# EAGLE schematic ATX_VGA_Analog_Board (EAGLE 9.6.2)
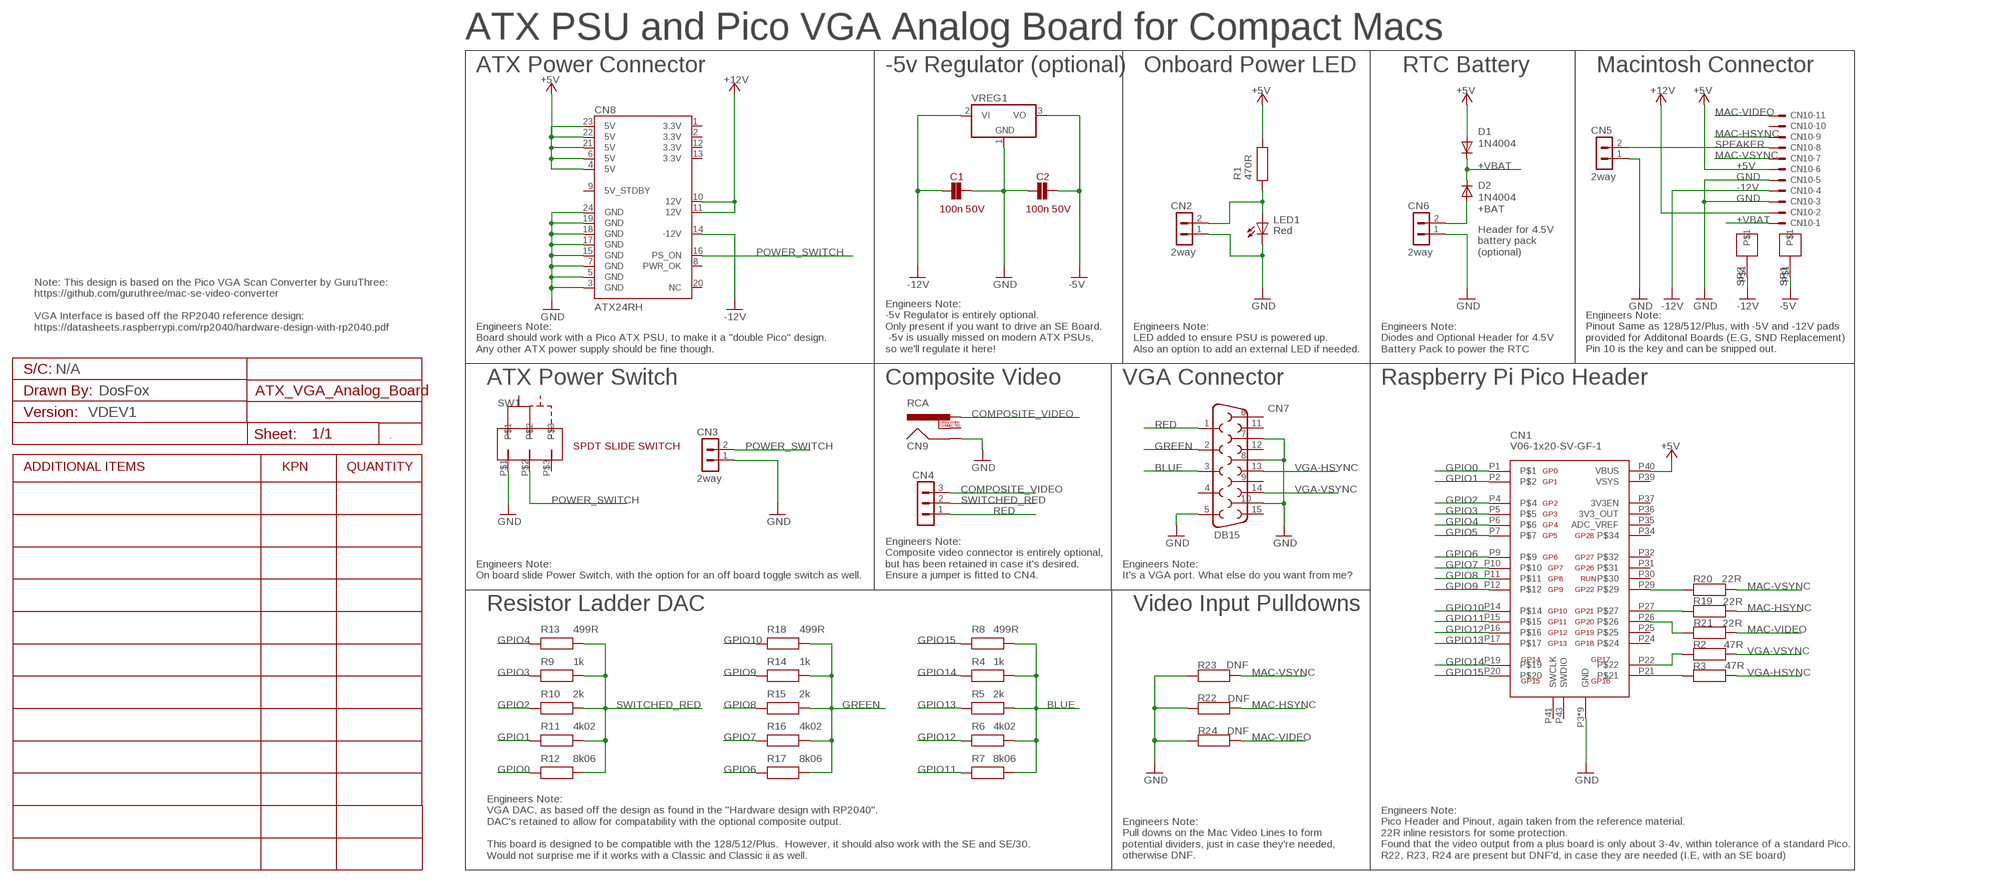
[diagram p0: schematic, sheet 1]

## Parts
A1  VDEV1  PROJECT_DETAILS_CUSTOM  [PCB_CUSTOM_DETAILS]
C1  100n 50V  100N_TH_CAP  [CAP_5.08MM_PITCH]
C2  100n 50V  100N_TH_CAP  [CAP_5.08MM_PITCH]
CN1  V06-1x20-SV-GF-1  PICO_BOARD  [PICO_SOCKET]
CN2  2way  PIN_HEADER_2W_VERT_TH  [2W_2.54MM_PITCH_VERT_TH]
CN3  2way  PIN_HEADER_2W_VERT_TH  [2W_2.54MM_PITCH_VERT_TH]
CN4  V06-1x3-SV-GF-1  PIN_HEADER_3W_VERT_FEMALE_TH  [3W_2.54MM_PITCH_VERT_TH]
CN5  2way  PIN_HEADER_2W_VERT_TH  [2W_2.54MM_PITCH_VERT_TH]
CN6  2way  PIN_HEADER_2W_VERT_TH  [2W_2.54MM_PITCH_VERT_TH]
CN7  DB15  [DB15]
CN8  ATX24RH  [ATX24_RIGHT_ANGLE]
CN9  RCA  [RCA]
CN10  KK-156-11  [KK-156-11]
D1  1N4004  [DO41-10]
D2  1N4004  [DO41-10]
LED1  Red  5MM_LED_RED  [5MM_TH_VERT_STANDARD]
R1  470R  470R_TH_RESISTOR  [RESISTORTHRUHOLE]
R2  47R  47R_TH_RESISTOR  [RESISTORTHRUHOLE]
R3  47R  47R_TH_RESISTOR  [RESISTORTHRUHOLE]
R4  1k  1K_TH_RESISTOR  [RESISTORTHRUHOLE]
R5  2k  2K2_TH_RESISTOR  [RESISTORTHRUHOLE]
R6  4k02  4K7_TH_RESISTOR  [RESISTORTHRUHOLE]
R7  8k06  68K_TH_RESISTOR  [RESISTORTHRUHOLE]
R8  499R  470R_TH_RESISTOR  [RESISTORTHRUHOLE]
R9  1k  1K_TH_RESISTOR  [RESISTORTHRUHOLE]
R10  2k  2K2_TH_RESISTOR  [RESISTORTHRUHOLE]
R11  4k02  4K7_TH_RESISTOR  [RESISTORTHRUHOLE]
R12  8k06  68K_TH_RESISTOR  [RESISTORTHRUHOLE]
R13  499R  470R_TH_RESISTOR  [RESISTORTHRUHOLE]
R14  1k  1K_TH_RESISTOR  [RESISTORTHRUHOLE]
R15  2k  2K2_TH_RESISTOR  [RESISTORTHRUHOLE]
R16  4k02  4K7_TH_RESISTOR  [RESISTORTHRUHOLE]
R17  8k06  68K_TH_RESISTOR  [RESISTORTHRUHOLE]
R18  499R  470R_TH_RESISTOR  [RESISTORTHRUHOLE]
R19  22R  22R_TH_RESISTOR  [RESISTORTHRUHOLE]
R20  22R  22R_TH_RESISTOR  [RESISTORTHRUHOLE]
R21  22R  22R_TH_RESISTOR  [RESISTORTHRUHOLE]
R22  DNF  22R_TH_RESISTOR  [RESISTORTHRUHOLE]
R23  DNF  22R_TH_RESISTOR  [RESISTORTHRUHOLE]
R24  DNF  22R_TH_RESISTOR  [RESISTORTHRUHOLE]
SP1  1PIN  [1PIN]
SP2  1PIN  [1PIN]
SW1  SS12D16-GDN5  [THRUHOLE90DEGSLIDESW]
VREG1  7905T  [TO220H]

## Nets
+5V: CN1.P40(VBUS) CN8.4(5V) CN8.6(5V) CN8.21(5V) CN8.22(5V) CN8.23(5V) CN10.6 D1.A R1.P$2 ; supply symbol labelled 3V3
+12V: CN8.10(12V) CN8.11(12V) CN10.2 ; supply symbol labelled 3V3
+BAT: CN6.2 D2.A
+VBAT: CN10.1 D1.C D2.C
-5V: C2.P$2 SP1.P$1 VREG1.3(VO) ; supply symbol labelled GND
-12V: C1.P$1 CN8.14(-12V) CN10.4 SP2.P$1 VREG1.2(VI) ; supply symbol labelled GND
BLUE: CN7.3 R4.P$2 R5.P$2 R6.P$2 R7.P$2 R8.P$2
COMPOSITE_VIDEO: CN4.3 CN9.PIN
GND: C1.P$2 C2.P$1 CN1.P3(GND) CN1.P8(GND) CN1.P13(GND) CN1.P18(GND) CN1.P23(GND) CN1.P28(GND) CN1.P33(GND) CN1.P38(GND) CN1.P42(GND) CN2.1 CN3.1 CN5.1 CN6.1 CN7.5 CN7.7 CN7.8 CN7.10 CN8.3(GND) CN8.5(GND) CN8.7(GND) CN8.15(GND) CN8.17(GND) CN8.18(GND) CN8.19(GND) CN8.24(GND) CN9.SHELL CN10.3 CN10.5 LED1.C R22.P$1 R23.P$1 R24.P$1 SW1.P$1 VREG1.1(GND)
GPIO0: CN1.P1 R12.P$1
GPIO1: CN1.P2 R11.P$1
GPIO2: CN1.P4 R10.P$1
GPIO3: CN1.P5 R9.P$1
GPIO4: CN1.P6 R13.P$1
GPIO5: CN1.P7
GPIO6: CN1.P9 R17.P$1
GPIO7: CN1.P10 R16.P$1
GPIO8: CN1.P11 R15.P$1
GPIO9: CN1.P12 R14.P$1
GPIO10: CN1.P14 R18.P$1
GPIO11: CN1.P15 R7.P$1
GPIO12: CN1.P16 R6.P$1
GPIO13: CN1.P17 R5.P$1
GPIO14: CN1.P19 R4.P$1
GPIO15: CN1.P20 R8.P$1
GREEN: CN7.2 R14.P$2 R15.P$2 R16.P$2 R17.P$2 R18.P$2
MAC-HSYNC: CN10.9 R19.P$2 R22.P$2
MAC-VIDEO: CN10.11 R21.P$2 R24.P$2
MAC-VSYNC: CN10.7 R20.P$2 R23.P$2
N$1: CN2.2 LED1.A R1.P$1
N$2: CN1.P22 R2.P$1
N$3: CN1.P21 R3.P$1
N$4: CN1.P29 R20.P$1
N$5: CN1.P27 R19.P$1
N$6: CN1.P26 R21.P$1
POWER_SWITCH: CN3.2 CN8.16(PS_ON) SW1.P$2
RED: CN4.1 CN7.1
SPEAKER: CN5.2 CN10.8
SWITCHED_RED: CN4.2 R9.P$2 R10.P$2 R11.P$2 R12.P$2 R13.P$2
VGA-HSYNC: CN7.13 R3.P$2
VGA-VSYNC: CN7.14 R2.P$2
Unconnected: CN1.P24 CN1.P25 CN1.P30 CN1.P31 CN1.P32 CN1.P34 CN1.P35(ADC_VREF) CN1.P36(3V3_OUT) CN1.P37(3V3EN) CN1.P39(VSYS) CN1.P41(SWCLK) CN1.P43(SWDIO) CN7.4 CN7.6 CN7.9 CN7.11 CN7.12 CN7.15 CN8.1(3.3V) CN8.2(3.3V) CN8.8(PWR_OK) CN8.9(5V_STDBY) CN8.12(3.3V) CN8.13(3.3V) CN8.20(NC) CN9.SWITCH CN10.10 SW1.P$3

## Notes on the sheet
- ATX PSU and Pico VGA Analog Board for Compact Macs
- ATX Power Connector | -5v Regulator (optional) | Onboard Power LED | RTC Battery | Macintosh Connector
- Header for 4.5V
  battery pack
  (optional)
- Note: This design is based on the Pico VGA Scan Converter by GuruThree:
  https://github.com/guruthree/mac-se-video-converter
  
  VGA Interface is based off the RP2040 reference design:
  https://datasheets.raspberrypi.com/rp2040/hardware-design-with-rp2040.pdf
- Engineers Note:
  Board should work with a Pico ATX PSU, to make it a "double Pico" design. 
  Any other ATX power supply should be fine though.
- Engineers Note:
  -5v Regulator is entirely optional. 
  Only present if you want to drive an SE Board.
   -5v is usually missed on modern ATX PSUs, 
  so we'll regulate it here!
- Engineers Note:
  LED added to ensure PSU is powered up.
  Also an option to add an external LED if needed.
- Engineers Note:
  Diodes and Optional Header for 4.5V
  Battery Pack to power the RTC
- Engineers Note:
  Pinout Same as 128/512/Plus, with -5V and -12V pads
  provided for Additonal Boards (E.G, SND Replacement)
  Pin 10 is the key and can be snipped out.
- N/A
- ATX Power Switch | Composite Video | VGA Connector | Raspberry Pi Pico Header
- DosFox
- Engineers Note:
  On board slide Power Switch, with the option for an off board toggle switch as well.
- Engineers Note:
  Composite video connector is entirely optional,
  but has been retained in case it's desired. 
  Ensure a jumper is fitted to CN4.
- Engineers Note:
  It's a VGA port. What else do you want from me?
- Resistor Ladder DAC | Video Input Pulldowns
- Engineers Note:
  VGA DAC, as based off the design as found in the "Hardware design with RP2040". 
  DAC's retained to allow for compatability with the optional composite output. 
  
  This board is designed to be compatible with the 128/512/Plus.  However, it should also work with the SE and SE/30. 
  Would not surprise me if it works with a Classic and Classic ii as well.
- Engineers Note:
  Pull downs on the Mac Video Lines to form 
  potential dividers, just in case they're needed,
  otherwise DNF.
- Engineers Note:
  Pico Header and Pinout, again taken from the reference material.
  22R inline resistors for some protection. 
  Found that the video output from a plus board is only about 3-4v, within tolerance of a standard Pico. 
  R22, R23, R24 are present but DNF'd, in case they are needed (I.E, with an SE board)

## Library data of the parts
A1 = Schematic Symbols:PROJECT_DETAILS
C1 C2 = Capacitors TH:100N_TH_CAP; COMPONENT: Capacitor; COST: =(INDIRECT(ADDRESS(ROW(),1)))*(INDIRECT(ADDRESS(ROW(),13))); EA: =VLOOKUP(INDIRECT(ADDRESS(ROW(),7)),[ProductCosts.xlsx]StockCosts!$A:$B,2,FALSE); KPN: 3101-100N; PACKAGE: 5.08mm PITCH; PROCESS: TH
CN1 = uProcessor:PICO_BOARD; COMPONENT: Pico Connector; COST: =(INDIRECT(ADDRESS(ROW(),1)))*(INDIRECT(ADDRESS(ROW(),13)))*2; DATASHEET: https://www.toby.co.uk/uploads/publications/2009.pdf; DETAILS: BOARD REQUIRES 2 CONNECTORS; EA: =VLOOKUP(INDIRECT(ADDRESS(ROW(),7)),[ProductCosts.xlsx]StockCosts!$A:$B,2,FALSE); KPN: 4189; PACKAGE: 2.54mm 20-way; PROCESS: TH
CN2 CN3 CN5 CN6 = Connectors:PIN_HEADER_2W_VERT_TH; COMPONENT: Pin Header (36way); COST: =(INDIRECT(ADDRESS(ROW(),1)))*(INDIRECT(ADDRESS(ROW(),13))); EA: =(VLOOKUP(INDIRECT(ADDRESS(ROW(),6)),'[ProductCosts.xlsx]StockCosts'!$A:$B,2,FALSE)/(36/(LEFT(INDIRECT(ADDRESS(ROW(),8)),SUM(LEN(INDIRECT(ADDRESS(ROW(),8)))-LEN(SUBSTITUTE(INDIRECT(ADDRESS(ROW(),8)),{"0","1","2","3","4","5","6","7","8","9"},""))))))); KPN: 4133; PACKAGE: 2.54mm pitch; PROCESS: TH
CN4 = Connectors:PIN_HEADER_3W_VERT_FEMALE_TH; COMPONENT: Pin Header Socket (3 Way); COST: =(INDIRECT(ADDRESS(ROW(),1)))*(INDIRECT(ADDRESS(ROW(),13))); DATASHEET: https://www.toby.co.uk/uploads/publications/2009.pdf; EA: =VLOOKUP(INDIRECT(ADDRESS(ROW(),7)),[ProductCosts.xlsx]StockCosts!$A:$B,2,FALSE); KPN: 4182; MANUFACTURE: Toby; PACKAGE: 2.54mm Pitch; PROCESS: TH
CN7 = SparkFun-Retired:DB15: DB15 / VGA right angle through-hole female connector.
CN8 = SparkFun-Connectors:ATX24: ATX24 Pin Power Supply Connector - Right Angle PTH Mount This is a good connector for connecting a computer power supply to a PCB. It's massive, but provides many amps of power at 5V and 12V. SparkFun Products: SparkFun Benchtop Power Board Kit <https://www.sparkfun.com/products/12867> SparkFun Power Driver Shield Kit <https://www.sparkfun.com/products/10618>; PROD_ID: CONN-09674; SF_ID: PRT-09498
CN9 = SparkFun-Connectors:RCA: RCA Jack connector This is a right angle RCA jack connecotr. Commonly used for video or audio. Here is the connector we sell at SparkFun: RCA Jack <https://www.sparkfun.com/products/8631> (PRT-08631) Datasheet <http://www.sparkfun.com/datasheets/Prototyping/Connectors/RCA-Jack.pdf> It is not used on any active designs, however it was used on a couple retired products: RCA Jack Breakout [RETIRED] <https://www.sparkfun.com/products/8826> (PRT-08826) SparkFun On Screen Display Breakout - MAX7456 [RETIRED] <https://www.sparkfun.com/products/9168> (BOB-09168) You may also be interested in a cable: RCA Video Cable - 6' <https://www.sparkfun.com/products/11573> (CAB-11573); PROD_ID: CONN-09081; SF_ID: PRT-08631
CN10 = con-molex:KK-156-11: KK 156 HEADER Source: http://www.molex.com/pdm_docs/sd/026604100_sd.pdf; MF: MOLEX; OC_FARNELL: unknown; OC_NEWARK: unknown
D1 D2 = adafruit:1N4004: DIODE General purpose 1N400x type rectifier (With bigger pads) http://www.ladyada.net/library/pcb/eaglelibrary.html
LED1 = Optoelectronics:5MM_LED_RED; COMPONENT: LED; COST: =(INDIRECT(ADDRESS(ROW(),1)))*(INDIRECT(ADDRESS(ROW(),13))); EA: =VLOOKUP(INDIRECT(ADDRESS(ROW(),7)),[ProductCosts.xlsx]StockCosts!$A:$B,2,FALSE); KPN: 3504; PACKAGE: 5mm Dia; PROCESS: TH
R1 = Resistors TH:470R_TH_RESISTOR; COMPONENT: Resistor; COST: =(INDIRECT(ADDRESS(ROW(),1)))*(INDIRECT(ADDRESS(ROW(),13))); EA: =(VLOOKUP(INDIRECT(ADDRESS(ROW(),6)),[ProductCosts.xlsx]StockCosts!$A:$B,2,FALSE))/1000; KPN: 3004-470R; PACKAGE: Axial Leaded; PROCESS: TH
R2 R3 = Resistors TH:47R_TH_RESISTOR; COMPONENT: Resistor; COST: =(INDIRECT(ADDRESS(ROW(),1)))*(INDIRECT(ADDRESS(ROW(),13))); EA: =(VLOOKUP(INDIRECT(ADDRESS(ROW(),6)),[ProductCosts.xlsx]StockCosts!$A:$B,2,FALSE))/1000; KPN: 3004-47R; PACKAGE: Axial Leaded; PROCESS: TH
R4 R9 R14 = Resistors TH:1K_TH_RESISTOR; COMPONENT: Resistor; COST: =(INDIRECT(ADDRESS(ROW(),1)))*(INDIRECT(ADDRESS(ROW(),13))); EA: =(VLOOKUP(INDIRECT(ADDRESS(ROW(),6)),[ProductCosts.xlsx]StockCosts!$A:$B,2,FALSE))/1000; KPN: 3004-1k; PACKAGE: Axial Leaded; PROCESS: TH
R5 R10 R15 = Resistors TH:2K2_TH_RESISTOR; COMPONENT: Resistor; COST: =(INDIRECT(ADDRESS(ROW(),1)))*(INDIRECT(ADDRESS(ROW(),13))); EA: =(VLOOKUP(INDIRECT(ADDRESS(ROW(),6)),[ProductCosts.xlsx]StockCosts!$A:$B,2,FALSE))/1000; KPN: 3004-2k2; PACKAGE: Axial Leaded; PROCESS: TH; VALUE: 2k2
R6 R11 R16 = Resistors TH:4K7_TH_RESISTOR; COMPONENT: Resistor; COST: =(INDIRECT(ADDRESS(ROW(),1)))*(INDIRECT(ADDRESS(ROW(),13))); EA: =(VLOOKUP(INDIRECT(ADDRESS(ROW(),6)),[ProductCosts.xlsx]StockCosts!$A:$B,2,FALSE))/1000; KPN: 3004-4k7; PACKAGE: Axial Leaded; PROCESS: TH; VALUE: 4k7
R7 R12 R17 = Resistors TH:68K_TH_RESISTOR; COMPONENT: Resistor; COST: =(INDIRECT(ADDRESS(ROW(),1)))*(INDIRECT(ADDRESS(ROW(),13))); EA: =(VLOOKUP(INDIRECT(ADDRESS(ROW(),6)),[ProductCosts.xlsx]StockCosts!$A:$B,2,FALSE))/1000; KPN: 3004-68k; PACKAGE: Axial Leaded; PROCESS: TH; VALUE: 68k
R8 R13 R18 = Resistors TH:470R_TH_RESISTOR; COMPONENT: Resistor; COST: =(INDIRECT(ADDRESS(ROW(),1)))*(INDIRECT(ADDRESS(ROW(),13))); EA: =(VLOOKUP(INDIRECT(ADDRESS(ROW(),6)),[ProductCosts.xlsx]StockCosts!$A:$B,2,FALSE))/1000; KPN: 3004-470R; PACKAGE: Axial Leaded; PROCESS: TH; VALUE: 470R
R19-R21 = Resistors TH:22R_TH_RESISTOR; COMPONENT: Resistor; COST: =(INDIRECT(ADDRESS(ROW(),1)))*(INDIRECT(ADDRESS(ROW(),13))); EA: =(VLOOKUP(INDIRECT(ADDRESS(ROW(),6)),[ProductCosts.xlsx]StockCosts!$A:$B,2,FALSE))/1000; KPN: 3004-22R; PACKAGE: Axial Leaded; PROCESS: TH
R22-R24 = Resistors TH:22R_TH_RESISTOR; COMPONENT: Resistor; COST: =(INDIRECT(ADDRESS(ROW(),1)))*(INDIRECT(ADDRESS(ROW(),13))); EA: =(VLOOKUP(INDIRECT(ADDRESS(ROW(),6)),[ProductCosts.xlsx]StockCosts!$A:$B,2,FALSE))/1000; KPN: 3004-22R; PACKAGE: Axial Leaded; PROCESS: TH; VALUE: 22R
SP1 SP2 = generic parts:1PIN
SW1 = Switches:SS12D16-GDN5; COMPONENT: Switch; COST: =(INDIRECT(ADDRESS(ROW(),1)))*(INDIRECT(ADDRESS(ROW(),13))); EA: =VLOOKUP(INDIRECT(ADDRESS(ROW(),7)),[ProductCosts.xlsx]StockCosts!$A:$B,2,FALSE); KPN: 3415; PROCESS: TH
VREG1 = linear:79*: Negative VOLTAGE REGULATOR